# Altium schematic sheet adc.SchDoc
size A4; Organization: Badgerloop; Address1: 133 Engineering Research; Address2: Building; Address3: Madison, WI 53715
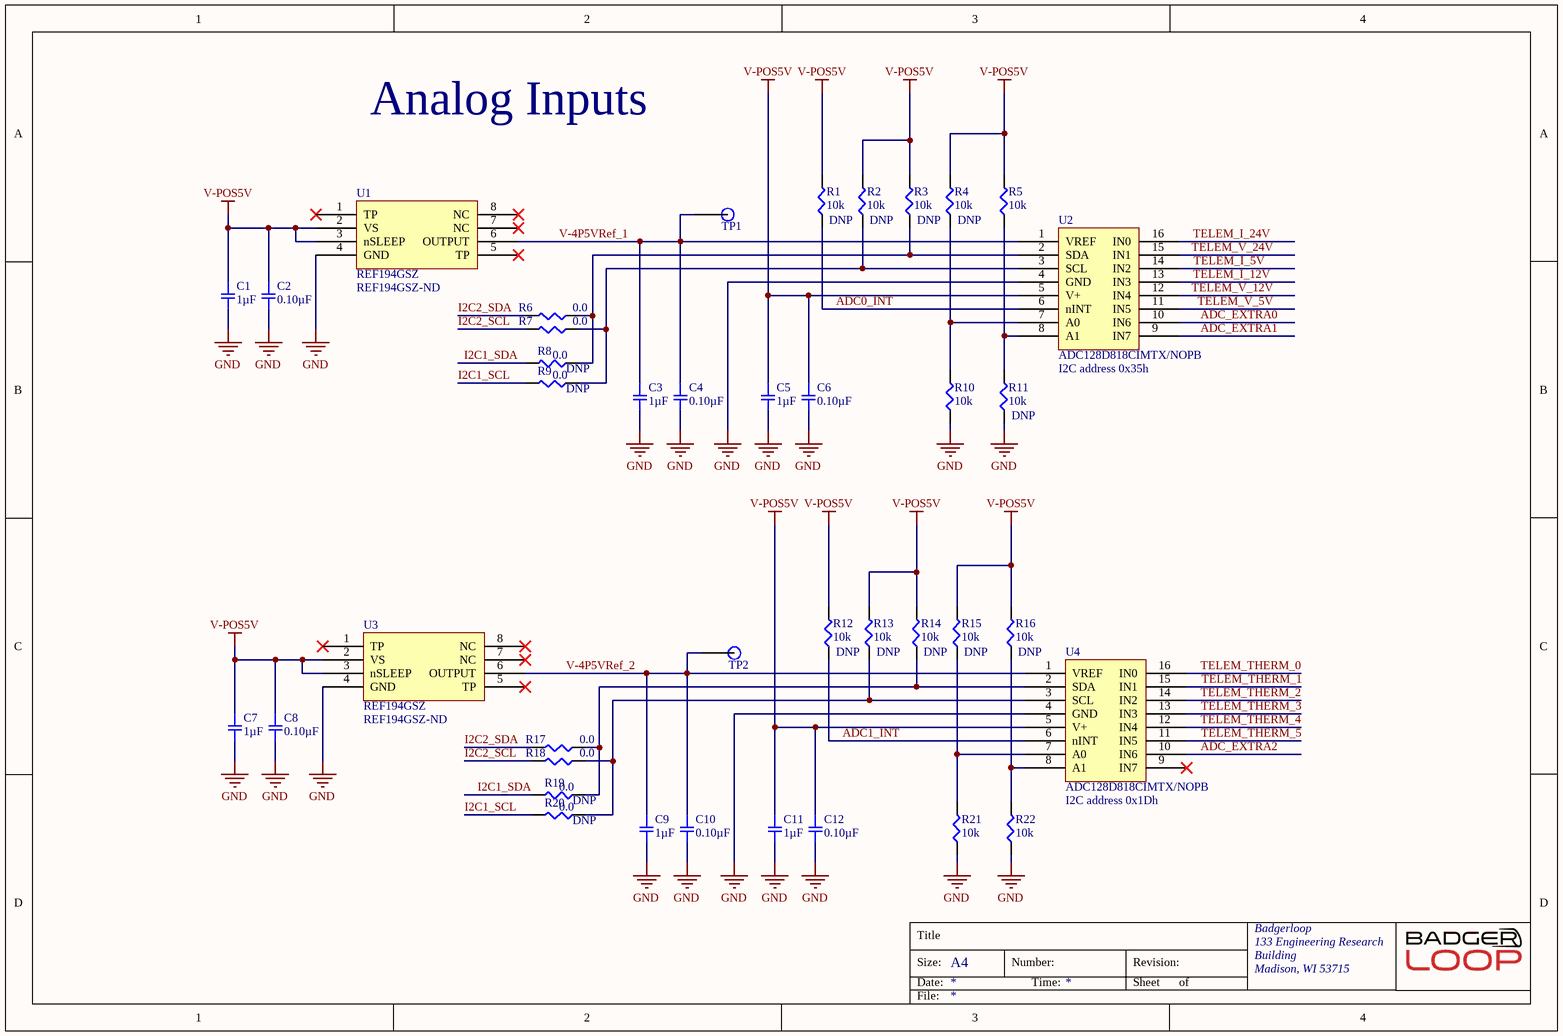
[diagram p0: adc.SchDoc]

## Parts
C1  1µF  [SMD-0805C]
C2  0.10µF  [SMD-0805C]
C3  1µF  [SMD-0805C]
C4  0.10µF  [SMD-0805C]
C5  1µF  [SMD-0805C]
C6  0.10µF  [SMD-0805C]
C7  1µF  [SMD-0805C]
C8  0.10µF  [SMD-0805C]
C9  1µF  [SMD-0805C]
C10  0.10µF  [SMD-0805C]
C11  1µF  [SMD-0805C]
C12  0.10µF  [SMD-0805C]
R1  10k  [SMD-0805-RES]
R2  10k  [SMD-0805-RES]
R3  10k  [SMD-0805-RES]
R4  10k  [SMD-0805-RES]
R5  10k  [SMD-0805-RES]
R6  0.0  [SMD-0805-RES]
R7  0.0  [SMD-0805-RES]
R8  0.0  [SMD-0805-RES]
R9  0.0  [SMD-0805-RES]
R10  10k  [SMD-0805-RES]
R11  10k  [SMD-0805-RES]
R12  10k  [SMD-0805-RES]
R13  10k  [SMD-0805-RES]
R14  10k  [SMD-0805-RES]
R15  10k  [SMD-0805-RES]
R16  10k  [SMD-0805-RES]
R17  0.0  [SMD-0805-RES]
R18  0.0  [SMD-0805-RES]
R19  0.0  [SMD-0805-RES]
R20  0.0  [SMD-0805-RES]
R21  10k  [SMD-0805-RES]
R22  10k  [SMD-0805-RES]
TP1  TP  [Test Point]  (value not drawn)
TP2  TP  [Test Point]  (value not drawn)
U1  REF194GSZ  Supplier Part Number 1: REF194GSZ-ND  [SOP127P600X175-8N]
U2  ADC128D818CIMTX/NOPB  [TSOP65P660X120-16N]
U3  REF194GSZ  Supplier Part Number 1: REF194GSZ-ND  [SOP127P600X175-8N]
U4  ADC128D818CIMTX/NOPB  [TSOP65P660X120-16N]

## Nets
GND: C1.2 C2.2 C3.2 C4.2 C5.2 C6.2 C7.2 C8.2 C9.2 C10.2 C11.2 C12.2 R10.1 R11.1 R21.1 R22.1 U1.4(GND) U2.4(GND) U3.4(GND) U4.4(GND)
V-POS5V: C1.1 C2.1 C5.1 C6.1 C7.1 C8.1 C11.1 C12.1 R1.2 R2.2 R3.2 R4.2 R5.2 R12.2 R13.2 R14.2 R15.2 R16.2 U1.2(VS) U1.3(nSLEEP) U2.5(V+) U3.2(VS) U3.3(nSLEEP) U4.5(V+)
ADC0_INT: R1.1 U2.6(nINT)
ADC1_INT: R12.1 U4.6(nINT)
ADC_EXTRA0: U2.10(IN6)
ADC_EXTRA1: U2.9(IN7)
ADC_EXTRA2: U4.10(IN6)
I2C1_SCL: R9.2 R20.2
I2C1_SDA: R8.2 R19.2
I2C2_SCL: R7.2 R18.2
I2C2_SDA: R6.2 R17.2
TELEM_I_5V: U2.14(IN2)
TELEM_I_12V: U2.13(IN3)
TELEM_I_24V: U2.16(IN0)
TELEM_THERM_0: U4.16(IN0)
TELEM_THERM_1: U4.15(IN1)
TELEM_THERM_2: U4.14(IN2)
TELEM_THERM_3: U4.13(IN3)
TELEM_THERM_4: U4.12(IN4)
TELEM_THERM_5: U4.11(IN5)
TELEM_V_5V: U2.11(IN5)
TELEM_V_12V: U2.12(IN4)
TELEM_V_24V: U2.15(IN1)
V-4P5VRef_1: C3.1 C4.1 TP1.1 U1.6(OUTPUT) U2.1(VREF)
V-4P5VRef_2: C9.1 C10.1 TP2.1 U3.6(OUTPUT) U4.1(VREF)
NetR2_1: R2.1 R7.1 R9.1 U2.3(SCL)
NetR3_1: R3.1 R6.1 R8.1 U2.2(SDA)
NetR4_1: R4.1 R10.2 U2.7(A0)
NetR5_1: R5.1 R11.2 U2.8(A1)
NetR13_1: R13.1 R18.1 R20.1 U4.3(SCL)
NetR14_1: R14.1 R17.1 R19.1 U4.2(SDA)
NetR15_1: R15.1 R21.2 U4.7(A0)
NetR16_1: R16.1 R22.2 U4.8(A1)

Not connected (* = marked no-connect by the designer): U1 1(TP)* 5(TP)* 7(NC)* 8(NC)*; U3 1(TP)* 5(TP)* 7(NC)* 8(NC)*; U4 9(IN7)*

## Notes on the sheet
- Analog Inputs
- (near U2) I2C address 0x35h
- (near U4) I2C address 0x1Dh
- Title
- Size:
- Date:
- A4
- Number:
- Time:
- Revision:
- Sheet
- of
- File:

## Library data of the parts
C1 C3 C5 C7 C9 C11 = GRM21BR71H105KA12L: CAP CER 1UF 50V X7R 0805; Manufacturer: Murata Electronics North America; Factory Stock: 0; Unit Price (USD): 0.25; Minimum Quantity: 1; Tolerance: ±10%; Datasheets: http://www.murata.com/~/media/webrenewal/support/library/catalog/products/capacitor/mlcc/c02e.pdf; Image: //media.digikey.com/Renders/Murata%20Renders/0805%20(2012%20Metric)%20.85mm.jpg; Digi-Key Part Number: 490-4736-1-ND; Part Number: GRM21BR71H105KA12L; Quantity Available: 988032; @ qty: 0; Packaging: Cut Tape (CT); Series: GRM; Part Status: Active; Value: 1µF; Voltage: 50V; Temperature Coefficient: X7R; Operating Temperature: -55°C ~ 125°C; Features: -; Ratings: -; Applications: General Purpose; Mounting Type: Surface Mount, MLCC; Package / Case: 0805 (2012 Metric); Size / Dimension: 0.079" L x 0.049" W (2.00mm x 1.25mm); Height - Seated (Max): -; Thickness (Max): 0.053" (1.35mm); Lead Spacing: -; Lead Style: -
C2 C4 C6 C8 C10 C12 = GCD21BR71H104KA01L: CAP CER 0.1UF 50V X7R 0805; Manufacturer: Murata Electronics North America; Factory Stock: 0; Unit Price (USD): 0.24; Minimum Quantity: 1; Tolerance: ±10%; Datasheets: http://www.murata.com/~/media/webrenewal/support/library/catalog/products/capacitor/mlcc/c03e.ashx; Image: //media.digikey.com/Renders/Murata%20Renders/0805%28GxM6%29.jpg; Digi-Key Part Number: 490-11955-1-ND; Part Number: GCD21BR71H104KA01L; Quantity Available: 157; @ qty: 0; Packaging: Cut Tape (CT); Series: GCD; Part Status: Active; Value: 0.10µF; Voltage: 50V; Temperature Coefficient: X7R; Operating Temperature: -55°C ~ 125°C; Features: -; Ratings: AEC-Q200; Applications: Automotive; Mounting Type: Surface Mount, MLCC; Package / Case: 0805 (2012 Metric); Size / Dimension: 0.079" L x 0.049" W (2.00mm x 1.25mm); Height - Seated (Max): -; Thickness (Max): 0.049" (1.25mm); Lead Spacing: -; Lead Style: -
R1-R5 R10-R16 R21 R22 = ERJ-P06J103V: RES SMD 10K OHM 5% 1/2W 0805; Manufacturer: Panasonic Electronic Components; Factory Stock: 0; Unit Price (USD): 0.01839; @ qty: 1500; Minimum Quantity: 1; Power (Watts): 0.5W, 1/2W; Temperature Coefficient: ±200ppm/°C; Part Number: ERJ-P06J103V; Datasheets: https://industrial.panasonic.com/cdbs/www-data/pdf/RDA0000/AOA0000C243.pdf; Image: //media.digikey.com/Renders/Panasonic%20Renders/ERJ-0805%20Pkg.jpg; Digi-Key Part Number: P10KADCT-ND; Quantity Available: 413576; Packaging: Cut Tape (CT); Series: ERJ; Part Status: Active; Value: 10k; Tolerance: ±5%; Composition: Thick Film; Features: Automotive AEC-Q200, Pulse Withstanding; Operating Temperature: -55°C ~ 155°C; Package / Case: 0805 (2012 Metric); Supplier Device Package: 0805; Size / Dimension: 0.079" L x 0.049" W (2.00mm x 1.25mm); Height - Seated (Max): 0.028" (0.70mm); Number of Terminations: 2; Failure Rate: -
  R1-R4 R11-R16: DNP: DNP
R6-R9 R17-R20 = ERJ-6GEY0R00V: RES SMD 0.0 OHM JUMPER 1/8W 0805; Manufacturer: Panasonic Electronic Components; Factory Stock: 0; Unit Price (USD): 0.00544; @ qty: 1500; Minimum Quantity: 1; Power (Watts): 0.125W, 1/8W; Part Number: ERJ-6GEY0R00V; Datasheets: http://industrial.panasonic.com/www-cgi/jvcr13pz.cgi?E+PZ+3+AOA0001+ERJ6GEY0R00V+7+WW; Image: //media.digikey.com/Renders/Panasonic%20Renders/ERJ-0805%20Pkg.jpg; Digi-Key Part Number: P0.0ACT-ND; Quantity Available: 1597627; Packaging: Cut Tape (CT); Series: ERJ; Part Status: Active; Value: 0.0; Tolerance: Jumper; Composition: Thick Film; Features: Automotive AEC-Q200; Temperature Coefficient: -; Operating Temperature: -55°C ~ 155°C; Package / Case: 0805 (2012 Metric); Supplier Device Package: 0805; Size / Dimension: 0.079" L x 0.049" W (2.00mm x 1.25mm); Height - Seated (Max): 0.028" (0.70mm); Number of Terminations: 2; Failure Rate: -
  R8 R9 R19 R20: DNP: DNP
TP1 TP2 = TP: SMD TEST POINT
U1 U3 = REF194GSZ: IC VREF SERIES 4.5V 8SOIC; Manufacturer: Analog Devices; Max Input Voltage: 18V; Max Output Current: 30mA; Temperature Coefficient: 25ppm/°C; Number of Channels: 1; Min Output Voltage: 4.49V; Operating Supply Current: 45uA; Quiescent Current: 15uA; Min Input Voltage: 4.75V; Supplier 1: Digi-Key; Manufacturer Part Number: REF194GSZ; Stock 1: 359; Pricing 1: 1=3.56000, 10=3.19700, 25=3.02240, 100=2.61940, 250=2.48512, 500=2.22988, 1000=1.88062, 2500=1.78659 (USD); RoHS: Yes; Case/Package: R; Number of Pins: 8; Min Operating Temperature: -40°C; Max Operating Temperature: 85°C; Output Voltage: 4.5V; Packaging: Rail/Tube; Output Current: 30mA; Max Output Voltage: 4.5V; Reference Type: Series; Package Quantity: 98; Nominal Supply Current: 45uA; Reference Voltage: 4.5V; Length: 5mm; Height: 1.5mm; Width: 4mm; Radiation Hardening: No; Lead Free: Contains Lead; REACH SVHC: No SVHC; ComponentLink1URL: https://datasheet.ciiva.com/17219/ref19xseries-17219157.pdf?src-supplier=Avnet+Europe; ComponentLink1Description: https://datasheet.ciiva.com/17219/ref19xseries-17219157.pdf?src-supplier=Avnet+Europe; ComponentLink2URL: https://datasheet.ciiva.com/22666/1506113-22666153.pdf?src-supplier=Element14; ComponentLink2Description: https://datasheet.ciiva.com/22666/1506113-22666153.pdf?src-supplier=Element14; ComponentLink3URL: https://datasheet.ciiva.com/2005/ref19xseries-2005902.pdf?src-supplier=Digi-Key; ComponentLink3Description: https://datasheet.ciiva.com/2005/ref19xseries-2005902.pdf?src-supplier=Digi-Key; ComponentLink4URL: https://datasheet.ciiva.com/3235/ref19xseries-3235518.pdf?src-supplier=Avnet; ComponentLink4Description: https://datasheet.ciiva.com/3235/ref19xseries-3235518.pdf?src-supplier=Avnet
U2 U4 = ADC128D818CIMTX/NOPB: Analog to Digital Converters - ADC; Manufacturer: TI National Semiconductor; Resolution: 12b; Sampling Rate: 10000S/s; Number of A/D Converters: 1; Polarity: Unipolar; Max Supply Voltage: 5.5V; Min Supply Voltage: 3V; Interface: I2C; Number of Channels: 8; Max Power Dissipation: 33mW; Number of Converters: 4; Number of Bits: 12; Integral Nonlinearity (INL): -2LSB; Supply Type: Analog,Digital,Single; Power Consumption: 2mW; Power Dissipation: 2.01mW; Differential Nonlinearity: 1LSB; Supplier 1: Digi-Key; Manufacturer Part Number: ADC128D818CIMTX/NOPB; Stock 1: 21177; Pricing 1: 1=4.68000, 10=4.20700, 100=3.44660, 500=2.93402, 1000=2.47447 (USD); RoHS: Yes; Mount: Surface Mount; Case/Package: TSSOP; Number of Pins: 16; Contact Plating: Tin,Matte; Min Operating Temperature: -40°C; Max Operating Temperature: 125°C; Packaging: Tape and Reel; Package Quantity: 2500; Number of Inputs: 8; Number of Elements: 1; Radiation Hardening: No; Lead Free: Lead Free; ComponentLink1URL: https://datasheet.ciiva.com/14259/adc128d818-14259977.pdf?src-supplier=Avnet; ComponentLink1Description: https://datasheet.ciiva.com/14259/adc128d818-14259977.pdf?src-supplier=Avnet; Supplier Part Number 1: 296-41182-1-ND